# Altium project Mio.PrjPcb
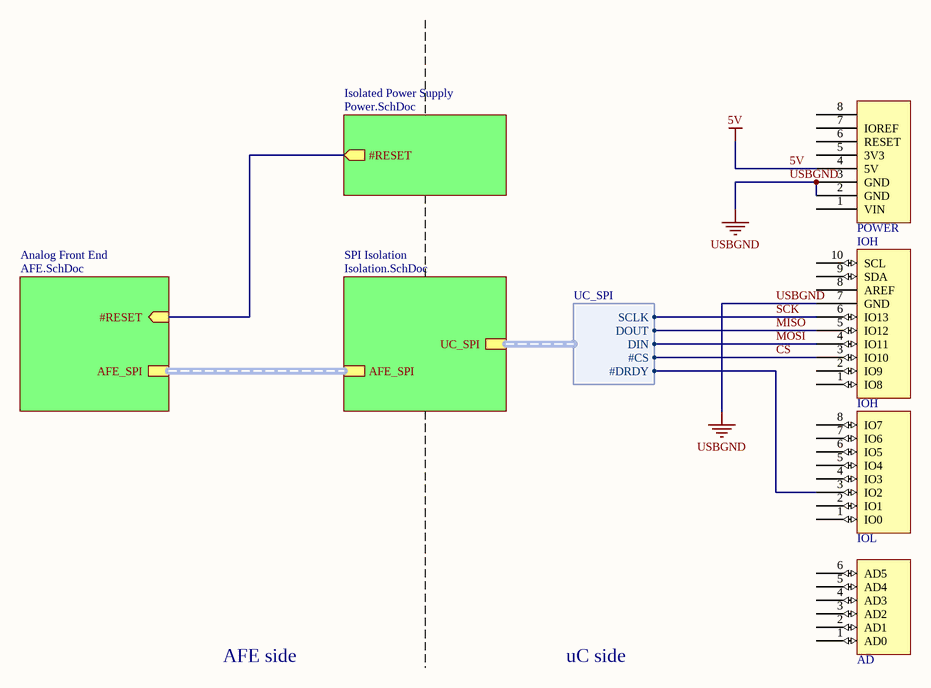
[diagram p0: MioShield.SchDoc]
4 sheets, 35 parts. Net scope: hierarchical (ports join the sheet entries above them; power ports are global).
Board file: MioShield.PcbDoc
Sheets:
  MioShield.SchDoc
    Analog Front End = AFE.SchDoc
    SPI Isolation = Isolation.SchDoc
    Isolated Power Supply = Power.SchDoc

## Sheet MioShield.SchDoc
size A4

### Parts
AD  AD  [Header 6x1 8.5mm]  (value not drawn)
IOH  IOH  [Header 10x1 8.5mm]
IOL  IOL  [Header 8x1 8.5mm]  (value not drawn)
POWER  POWER_UNO  [Header 8x1 8.5mm]  (value not drawn)

### Sub-sheets
Analog Front End = AFE.SchDoc: #RESET (in), AFE_SPI (harness AFE_SPI)
Isolated Power Supply = Power.SchDoc: #RESET (out)
SPI Isolation = Isolation.SchDoc: AFE_SPI (harness AFE_SPI), UC_SPI (harness UC_SPI)

### Harnesses
UC_SPI: #CS, #DRDY, DIN, DOUT, SCLK

### Nets
5V: POWER.4(5V)
USBGND: IOH.7(GND) POWER.2(GND) POWER.3(GND)
CS: IOH.3(IO10) ; sheet SPI Isolation/UC_SPI.#CS
MISO: IOH.5(IO12) ; sheet SPI Isolation/UC_SPI.DOUT
MOSI: IOH.4(IO11) ; sheet SPI Isolation/UC_SPI.DIN
SCK: IOH.6(IO13) ; sheet SPI Isolation/UC_SPI.SCLK
NetIC1_15: sheet Analog Front End/#RESET, sheet Isolated Power Supply/#RESET
NetIC2_6: IOL.3(IO2) ; sheet SPI Isolation/UC_SPI.#DRDY

Not connected (* = marked no-connect by the designer): AD 1(AD0) 2(AD1) 3(AD2) 4(AD3) 5(AD4) 6(AD5); IOH 1(IO8) 2(IO9) 8(AREF) 9(SDA) 10(SCL); IOL 1(IO0) 2(IO1) 4(IO3) 5(IO4) 6(IO5) 7(IO6) 8(IO7); POWER 1(VIN) 5(3V3) 6(RESET) 7(IOREF) 8

### Buses and harness runs
harness sheet Analog Front End/AFE_SPI = sheet SPI Isolation/AFE_SPI

### Notes on the sheet
- AFE side
- uC side

## Sheet AFE.SchDoc: AFE
size A4; Author: Samuel López Asunción; ProjectName: Mio
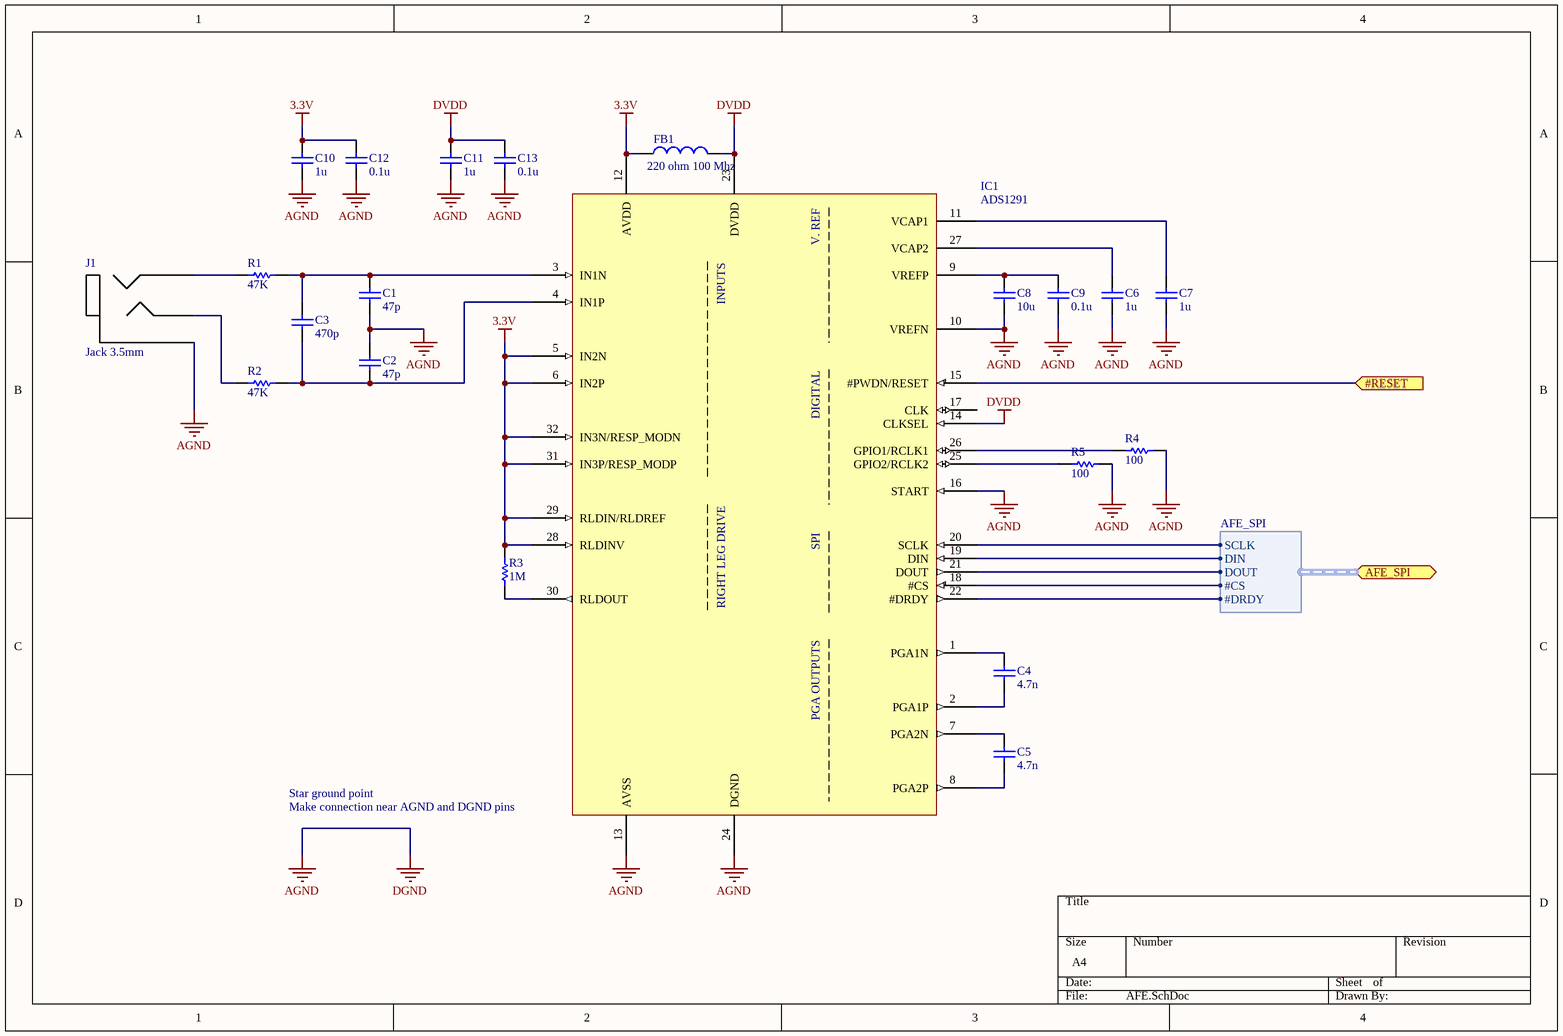
[diagram p1: AFE.SchDoc]

### Parts
C1  47p  [0805 CAP]
C2  47p  [0805 CAP]
C3  470p  [0805 CAP]
C4  4.7n  [0805 CAP]
C5  4.7n  [0805 CAP]
C6  1u  [0805 CAP]
C7  1u  [0805 CAP]
C8  10u  [0805 CAP]
C9  0.1u  [0805 CAP]
C10  1u  [0805 CAP]
C11  1u  [0805 CAP]
C12  0.1u  [0805 CAP]
C13  0.1u  [0805 CAP]
FB1  220 ohm 100 Mhz  [0805 Ind]
IC1  ADS1291  [TSQFP50P700X700X120-32N]
J1  Jack 3.5mm  [Jack 3.5mm]
R1  47K  [0805 Res]
R2  47K  [0805 Res]
R3  1M  [0805 Res]
R4  100  [0805 Res]
R5  100  [0805 Res]

### Ports
#RESET (in), AFE_SPI (harness AFE_SPI)

### Harnesses
AFE_SPI: SCLK, DIN, DOUT, #CS, #DRDY

### Nets
3.3V: C10.2 C12.2 FB1.1 IC1.5(IN2N) IC1.6(IN2P) IC1.12(AVDD) IC1.28(RLDINV) IC1.29(RLDIN/RLDREF) IC1.31(IN3P/RESP_MODP) IC1.32(IN3N/RESP_MODN) R3.2
AGND: C1.1 C2.2 C6.1 C7.1 C8.1 C9.1 C10.1 C11.1 C12.1 C13.1 IC1.10(VREFN) IC1.13(AVSS) IC1.16(START) IC1.24(DGND) J1.1(Sleeve) R4.1 R5.1  [also labelled DGND]
DVDD: C11.2 C13.2 FB1.2 IC1.14(CLKSEL) IC1.23(DVDD)
NetC1_2: C1.2 C3.2 IC1.3(IN1N) R1.2
NetC2_1: C2.1 C3.1 IC1.4(IN1P) R2.2
NetC4_1: C4.1 IC1.2(PGA1P)
NetC4_2: C4.2 IC1.1(PGA1N)
NetC5_1: C5.1 IC1.8(PGA2P)
NetC5_2: C5.2 IC1.7(PGA2N)
NetC6_2: C6.2 IC1.27(VCAP2)
NetC7_2: C7.2 IC1.11(VCAP1)
NetC8_2: C8.2 C9.2 IC1.9(VREFP)
NetIC1_15: IC1.15(#PWDN/RESET) ; port #RESET
NetIC1_18: IC1.18(#CS) ; port AFE_SPI.#CS
NetIC1_19: IC1.19(DIN) ; port AFE_SPI.DIN
NetIC1_20: IC1.20(SCLK) ; port AFE_SPI.SCLK
NetIC1_21: IC1.21(DOUT) ; port AFE_SPI.DOUT
NetIC1_22: IC1.22(#DRDY) ; port AFE_SPI.#DRDY
NetIC1_25: IC1.25(GPIO2/RCLK2) R5.2
NetIC1_26: IC1.26(GPIO1/RCLK1) R4.2
NetIC1_30: IC1.30(RLDOUT) R3.1
NetJ1_2: J1.2(Tip) R2.1
NetJ1_3: J1.3(Ring) R1.1

Not connected (* = marked no-connect by the designer): IC1 17(CLK)

### Notes on the sheet
- Star ground point
- (near IC1) Make connection near AGND and DGND pins
- (in symbol ADS1291) V. REF; INPUTS; DIGITAL; RIGHT LEG DRIVE; SPI; PGA OUTPUTS

### Library data of the parts
C1-C13 = Cap
  C1 C2: Value: 47p
  C3: Value: 470p
  C4 C5: Value: 4.7n
  C6 C7 C10 C11: Value: 1u
  C8: Value: 10u
  C9 C12 C13: Value: 0.1u
FB1 = Ferrita: INDUCTOR, 0.04OHM, 3A, 0805; Value: 220 ohm 100 Mhz
R1-R5 = Res
  R1 R2: Value: 47K
  R3: Value: 1M
  R4 R5: Value: 100

## Sheet Isolation.SchDoc
size A4
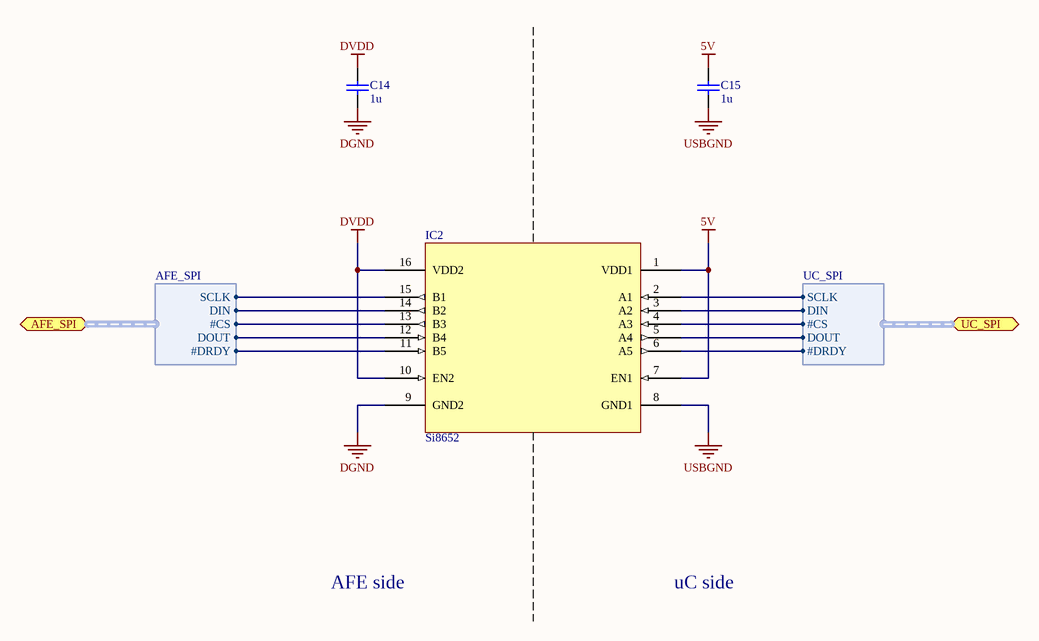
[diagram p2: Isolation.SchDoc]

### Parts
C14  1u  [0805 CAP]
C15  1u  [0805 CAP]
IC2  Si8652  [SOIC127P600X175-16N]

### Ports
AFE_SPI (harness AFE_SPI), UC_SPI (harness UC_SPI)

### Harnesses
AFE_SPI: #CS, #DRDY, DIN, DOUT, SCLK
UC_SPI: SCLK, DIN, #CS, DOUT, #DRDY

### Nets
5V: C15.2 IC2.1(VDD1) IC2.7(EN1)
DGND: C14.1 IC2.9(GND2)  [project net AGND]
DVDD: C14.2 IC2.10(EN2) IC2.16(VDD2)
USBGND: C15.1 IC2.8(GND1)
CS: IC2.4(A3) ; port UC_SPI.#CS
MISO: IC2.5(A4) ; port UC_SPI.DOUT
MOSI: IC2.3(A2) ; port UC_SPI.DIN
SCK: IC2.2(A1) ; port UC_SPI.SCLK
NetIC1_18: IC2.13(B3) ; port AFE_SPI.#CS
NetIC1_19: IC2.14(B2) ; port AFE_SPI.DIN
NetIC1_20: IC2.15(B1) ; port AFE_SPI.SCLK
NetIC1_21: IC2.12(B4) ; port AFE_SPI.DOUT
NetIC1_22: IC2.11(B5) ; port AFE_SPI.#DRDY
NetIC2_6: IC2.6(A5) ; port UC_SPI.#DRDY

### Notes on the sheet
- AFE side
- uC side

### Library data of the parts
C14 C15 = Cap: Value: 1u

## Sheet Power.SchDoc
size A4
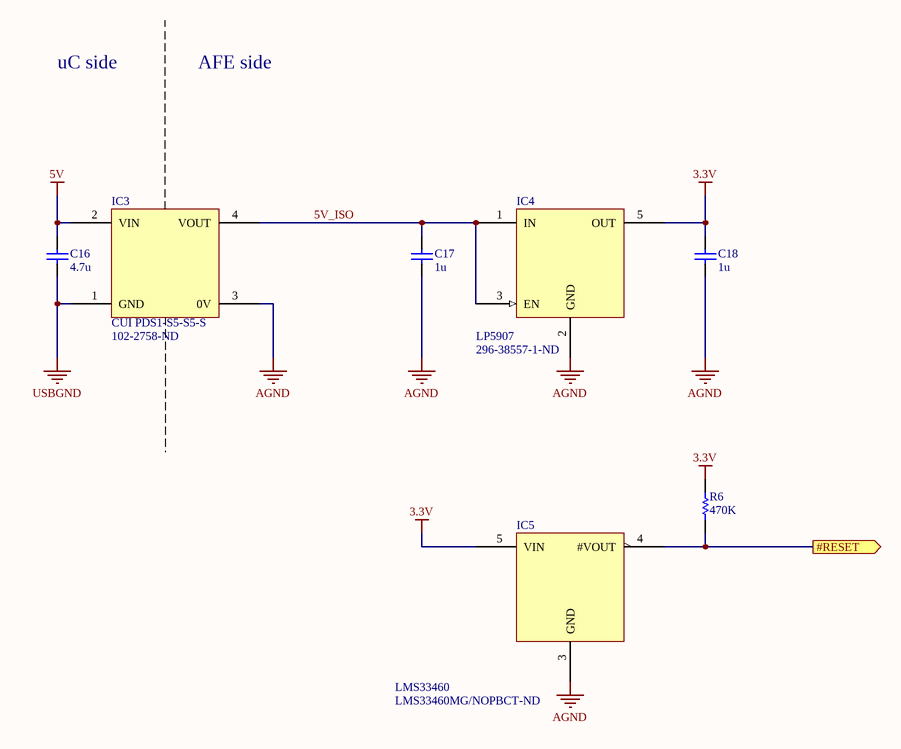
[diagram p3: Power.SchDoc]

### Parts
C16  4.7u  [0805 CAP]
C17  1u  [0805 CAP]
C18  1u  [0805 CAP]
IC3  CUI PDS1-S5-S5-S  Supplier Part Number 1: 102-2758-ND  [SIL4]
IC4  LP5907  Supplier Part Number 1: 296-38557-1-ND  [SOT95P280X145-5N]
IC5  LMS33460  Supplier Part Number 1: LMS33460MG/NOPBCT-ND  [SOT65P210X110-5N]
R6  470K  [0805 Res]

### Ports
#RESET (out)

### Nets
3.3V: C18.2 IC4.5(OUT) IC5.5(VIN) R6.2
5V: C16.2 IC3.2(VIN)
AGND: C17.1 C18.1 IC3.3(0V) IC4.2(GND) IC5.3(GND)
USBGND: C16.1 IC3.1(GND)
5V_ISO: C17.2 IC3.4(VOUT) IC4.1(IN) IC4.3(EN)
NetIC1_15: IC5.4(#VOUT) R6.1 ; port #RESET

### Notes on the sheet
- uC side
- AFE side

### Library data of the parts
C16-C18 = Cap
  C16: Value: 4.7u
  C17 C18: Value: 1u
R6 = Res: Value: 470K
IC3 = CUI PDS1-S5-S5-S: Supplier 1: Digi-Key
IC4 = LP5907: Supplier 1: Digi-Key
IC5 = LMS33460: Supplier 1: Digi-Key

## Nets that join several sheets
3.3V: AFE (11 pins), Power (C18.2 IC4.5 IC5.5 R6.2)
5V: MioShield (POWER.4), Isolation (C15.2 IC2.1 IC2.7), Power (C16.2 IC3.2)
AGND: AFE (17 pins), Isolation (C14.1 IC2.9), Power (5 pins)
DVDD: AFE (5 pins), Isolation (C14.2 IC2.10 IC2.16)
USBGND: MioShield (IOH.7 POWER.2 POWER.3), Isolation (C15.1 IC2.8), Power (C16.1 IC3.1)
CS: MioShield (IOH.3), Isolation (IC2.4)
MISO: MioShield (IOH.5), Isolation (IC2.5)
MOSI: MioShield (IOH.4), Isolation (IC2.3)
NetIC1_15: AFE (IC1.15), Power (IC5.4 R6.1)
NetIC1_18: AFE (IC1.18), Isolation (IC2.13)
NetIC1_19: AFE (IC1.19), Isolation (IC2.14)
NetIC1_20: AFE (IC1.20), Isolation (IC2.15)
NetIC1_21: AFE (IC1.21), Isolation (IC2.12)
NetIC1_22: AFE (IC1.22), Isolation (IC2.11)
NetIC2_6: MioShield (IOL.3), Isolation (IC2.6)
SCK: MioShield (IOH.6), Isolation (IC2.2)